# EAGLE design tinyI2C (EAGLE 7.5.0)
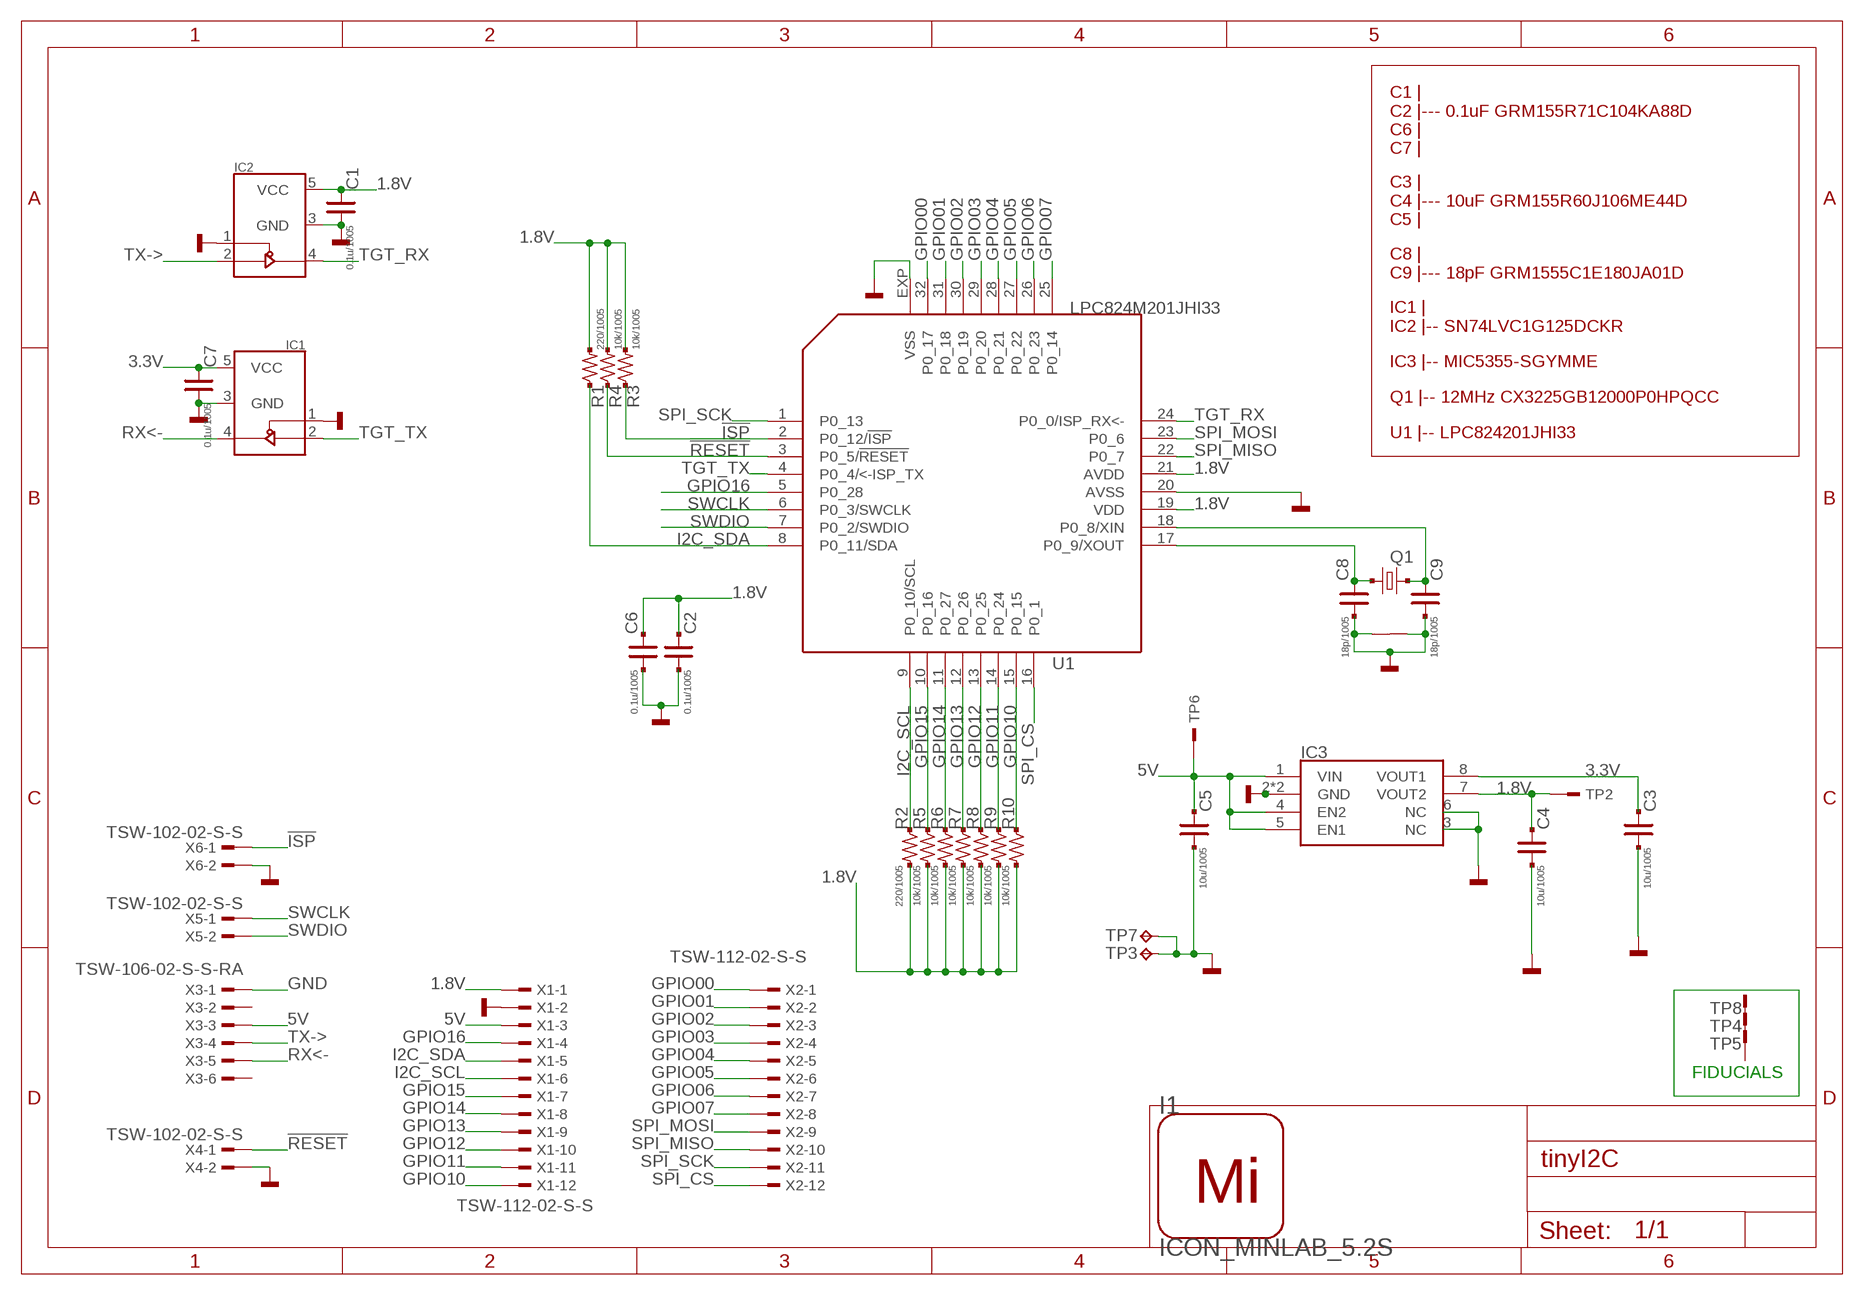
[diagram p0: schematic, sheet 1]

## Parts
C1  0.1u/1005  C_SMD_0.1U_1005  [C0402]
C2  0.1u/1005  C_SMD_0.1U_1005  [C0402]
C3  10u/1005  C_SMD_10U_1005  [C0402]
C4  10u/1005  C_SMD_10U_1005  [C0402]
C5  10u/1005  C_SMD_10U_1005  [C0402]
C6  0.1u/1005  C_SMD_0.1U_1005  [C0402]
C7  0.1u/1005  C_SMD_0.1U_1005  [C0402]
C8  18p/1005  C_SMD_18P_1005  [C0402]
C9  18p/1005  C_SMD_18P_1005  [C0402]
I1  ICON_MINLAB_5.2S  [ICON_MINLAB_5.2MM]
IC1  74LVC1G125_SC70  [IC_05_0.635_40MIL]
IC2  74LVC1G125_SC70  [IC_05_0.635_40MIL]
IC3  IC_LDO_MIC5355_3.3/1.8  [IC_08_0.65_160MIL_EP]
Q1  CRYSTAL4_12M_3225  [CLOCK_3225]
R1  220/1005  R_US_220R_1005  [C0402]
R2  220/1005  R_US_220R_1005  [C0402]
R3  10k/1005  R_US_10K_1005  [C0402]
R4  10k/1005  R_US_10K_1005  [C0402]
R5  10k/1005  R_US_10K_1005  [C0402]
R6  10k/1005  R_US_10K_1005  [C0402]
R7  10k/1005  R_US_10K_1005  [C0402]
R8  10k/1005  R_US_10K_1005  [C0402]
R9  10k/1005  R_US_10K_1005  [C0402]
R10  10k/1005  R_US_10K_1005  [C0402]
TP2  TESTPAD  [TP06RECT]
TP3  TPTP14R  [TP14R]
TP4  TESTPAD_F  [FIDUCIAL]
TP5  TESTPAD_F  [FIDUCIAL]
TP6  TESTPAD  [TP06RECT]
TP7  TPTP14R  [TP14R]
TP8  TESTPAD_F  [FIDUCIAL]
U1  LPC824M201JHI33  [HVQFN33]
X1  TSW-112-02-S-S  [TSW-112-02-S-S]
X2  TSW-112-02-S-S  [TSW-112-02-S-S]
X3  TSW-106-02-S-S-RA  [TSW-106-02-S-S-RA]
X4  TSW-102-02-S-S  [TSW-102-02-S-S]
X5  TSW-102-02-S-S  [TSW-102-02-S-S]
X6  TSW-102-02-S-S  [TSW-102-02-S-S]

## Nets
1.8V: C1.1 C2.1 C4.1 C6.1 IC2.5(VCC) IC3.7(VOUT2) R1.2 R2.2 R3.2 R4.2 R5.2 R6.2 R7.2 R8.2 R9.2 R10.2 TP2.TP U1.19(VDD) U1.21(AVDD) X1.1
3.3V: C3.1 C7.1 IC1.5(VCC) IC3.8(VOUT1)
5V: C5.1 IC3.1(VIN) IC3.4(EN2) IC3.5(EN1) TP6.TP X1.3 X3.3
!ISP!: R3.1 U1.2(P0_12/!ISP!) X6.1
!RESET!: R4.1 U1.3(P0_5/!RESET!) X4.1
GND: C1.2 C2.2 C3.2 C4.2 C5.2 C6.2 C7.2 C8.2 C9.2 IC1.1(!OE!) IC1.3(GND) IC2.1(!OE!) IC2.3(GND) IC3.2(GND) IC3.3(NC) IC3.6(NC) IC3.EXP(GND) Q1.2 Q1.4 TP3.TP TP7.TP U1.20(AVSS) U1.EXP(VSS) X1.2 X3.1 X4.2 X6.2
GPIO00: U1.32(P0_17) X2.1
GPIO01: U1.31(P0_18) X2.2
GPIO02: U1.30(P0_19) X2.3
GPIO03: U1.29(P0_20) X2.4
GPIO04: U1.28(P0_21) X2.5
GPIO05: U1.27(P0_22) X2.6
GPIO06: U1.26(P0_23) X2.7
GPIO07: U1.25(P0_14) X2.8
GPIO10: R10.1 U1.15(P0_15) X1.12
GPIO11: R9.1 U1.14(P0_24) X1.11
GPIO12: R8.1 U1.13(P0_25) X1.10
GPIO13: R7.1 U1.12(P0_26) X1.9
GPIO14: R6.1 U1.11(P0_27) X1.8
GPIO15: R5.1 U1.10(P0_16) X1.7
GPIO16: U1.5(P0_28) X1.4
I2C_SCL: R2.1 U1.9(P0_10/SCL) X1.6
I2C_SDA: R1.1 U1.8(P0_11/SDA) X1.5
N$1: C8.1 Q1.1 U1.17(P0_9/XOUT)
N$3: C9.1 Q1.3 U1.18(P0_8/XIN)
RX<-: IC1.4(Y) X3.5
SPI_CS: U1.16(P0_1) X2.12
SPI_MISO: U1.22(P0_7) X2.10
SPI_MOSI: U1.23(P0_6) X2.9
SPI_SCK: U1.1(P0_13) X2.11
SWCLK: U1.6(P0_3/SWCLK) X5.1
SWDIO: U1.7(P0_2/SWDIO) X5.2
TGT_RX: IC2.4(Y) U1.24(P0_0/ISP_RX<-)
TGT_TX: IC1.2(A) U1.4(P0_4/<-ISP_TX)
TX->: IC2.2(A) X3.4
Unconnected: TP4.TP TP5.TP TP8.TP X3.2 X3.6

## Notes on the sheet
- C1 |
  C2 |--- 0.1uF GRM155R71C104KA88D
  C6 |
  C7 |
- C3 |
  C4 |--- 10uF GRM155R60J106ME44D
  C5 |
- C8 |
  C9 |--- 18pF GRM1555C1E180JA01D
- IC1 |
  IC2 |-- SN74LVC1G125DCKR
- IC3 |-- MIC5355-SGYMME
- Q1 |-- 12MHz CX3225GB12000P0HPQCC
- U1 |-- LPC824201JHI33
- FIDUCIALS

## Library data of the parts
C1 C2 C6 C7 = mylib:C_SMD_*: SMD CAPACITOR : PAD - PAD; DIGIKEY: 490-3261-1-ND
C3-C5 = mylib:C_SMD_*: SMD CAPACITOR : PAD - PAD; MOUSER: 81-GRM155R60J106ME4D
C8 C9 = mylib:C_SMD_*: SMD CAPACITOR : PAD - PAD; DIGIKEY: 490-5858-1-ND
I1 = mylib:ICON_MINLAB
IC1 IC2 = mylib:74*1G125: SINGLE BUS BUFFER GATE w/ 3-State Output; MOUSER: 595-SN74LVC1G125DCKR
IC3 = mylib:IC_LDO_MIC5355_*; DIGIKEY: 576-3882-5-ND; MOUSER: 998-MIC5355-SGYMME
Q1 = mylib:CRYSTAL4_*; DIGIKEY: 1253-1168-1-ND
R1 R2 = mylib:R_US_*: R_US_PAD_PAD : SMD R PAD is NTH-NTH Packages : _1608 : 1.6 x 0.8 mm _2125 : 2.0 x 1.25 mm _3216 : 3.2 x 1.6 mm
R3-R10 = mylib:R_US_*: R_US_PAD_PAD : SMD R PAD is NTH-NTH Packages : _1608 : 1.6 x 0.8 mm _2125 : 2.0 x 1.25 mm _3216 : 3.2 x 1.6 mm; DIGIKEY: P10.0KLCT-ND
TP2 TP4-TP6 TP8 = mylib:TESTPAD
TP3 TP7 = testpad_local:TP: Test pad
U1 = mylib:LPC824M201JHI33
X1 X2 = con-samtec.local:TSW-112-02-S-S: THROUGH-HOLE .025" SQ POST HEADER Source: Samtec TSW.pdf
X3 = con-samtec.local:TSW-106-02-S-S: THROUGH-HOLE .025" SQ POST HEADER Source: Samtec TSW.pdf
X4-X6 = con-samtec.local:TSW-102-02-S-S: THROUGH-HOLE .025" SQ POST HEADER Source: Samtec TSW.pdf

## Net classes
0 default: clearance 0.2 mm
1 power: clearance 0.2 mm

## Board
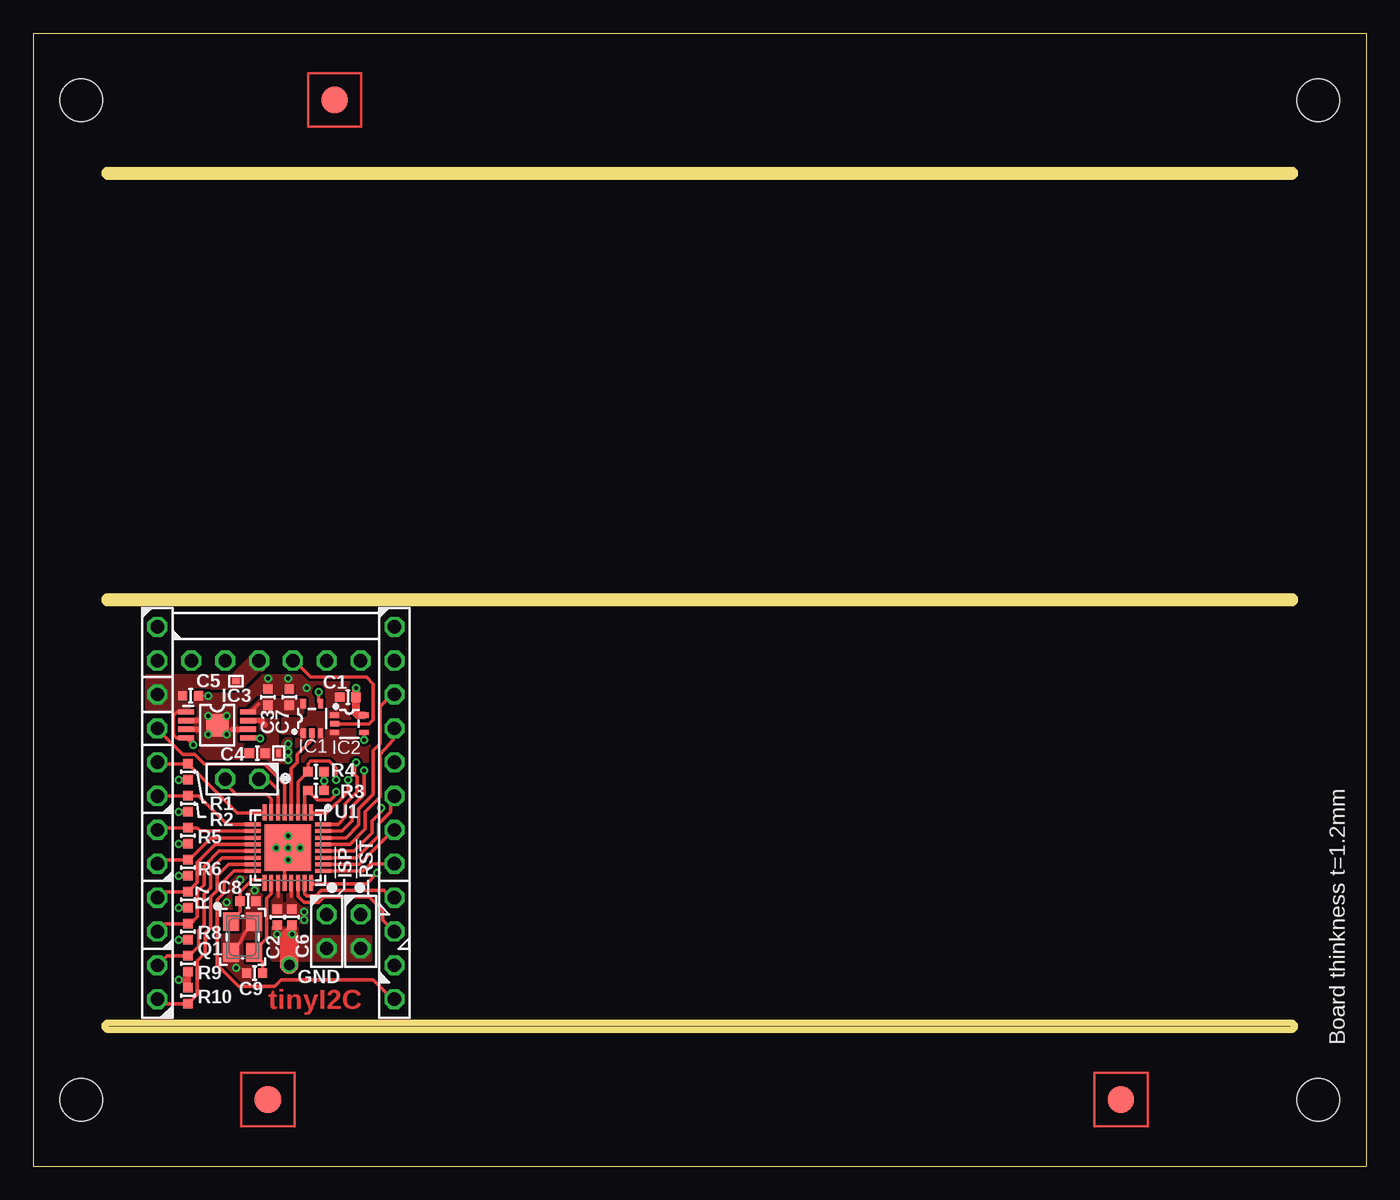
[diagram p1: board, top side]
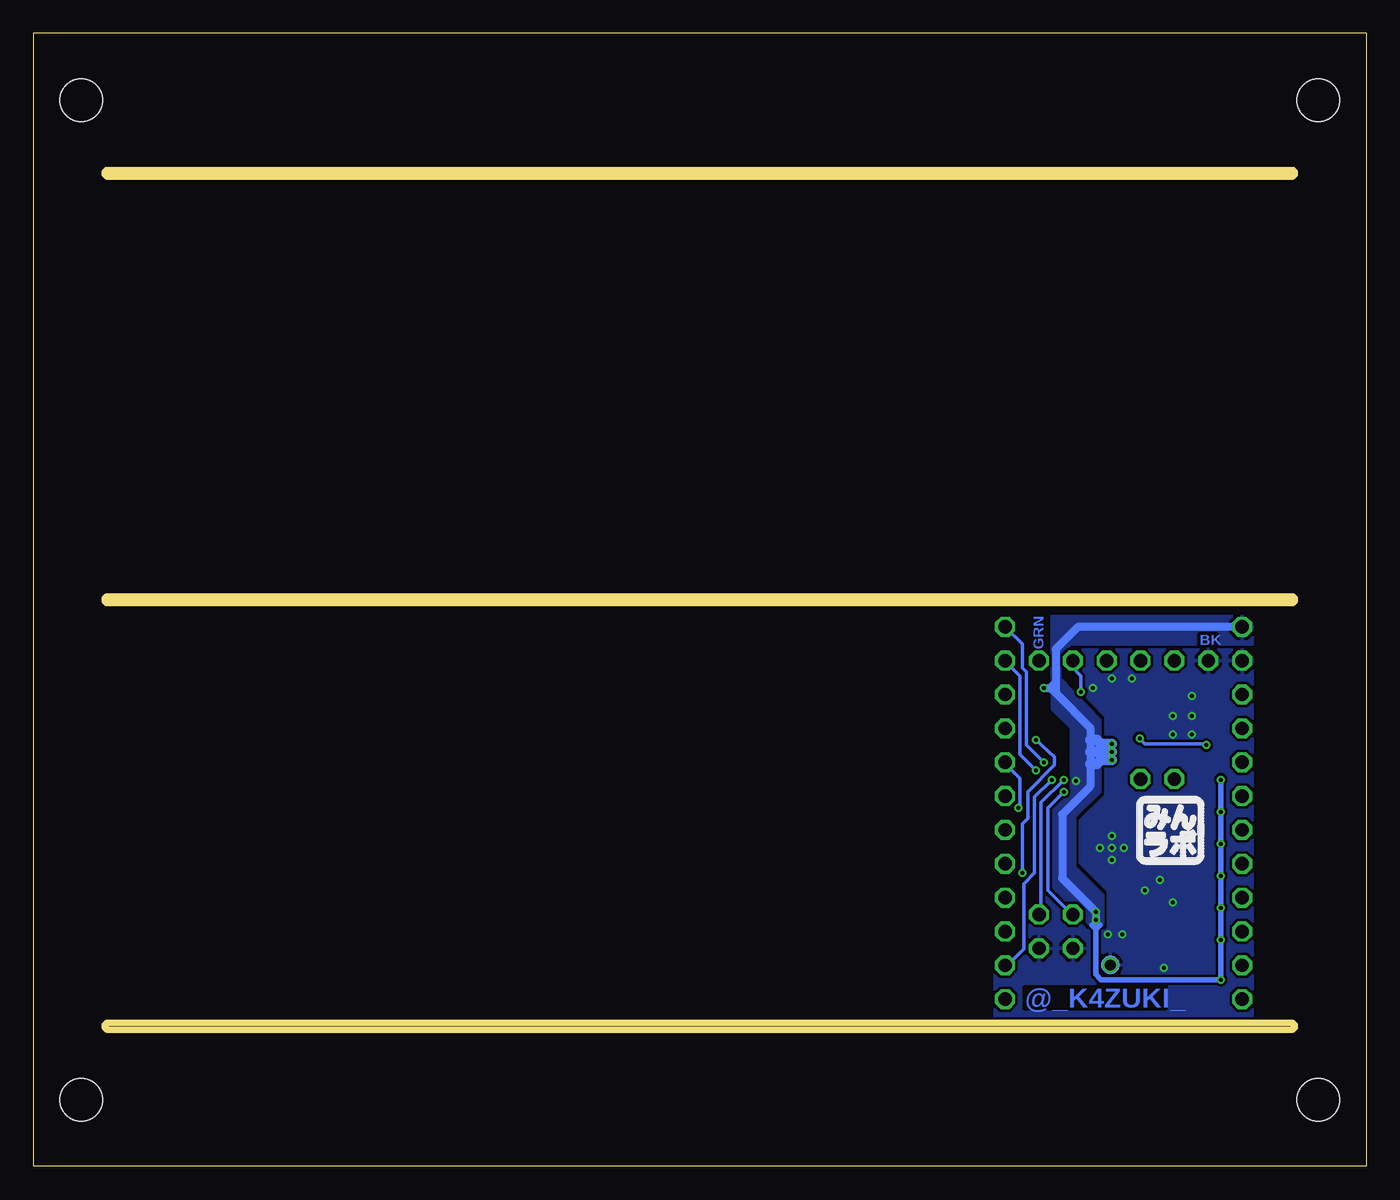
[diagram p2: board, bottom side, seen from below]

Size 100 x 85 mm. Coordinates in mm from the lower left corner, seen from the top.
Outline: 0,85 100,85 100,0 0,0 0,85
Copper layers (1*16): Top 0.035mm / dielectric 1.5mm / Bottom 0.035mm
Design rules "default *": minimum track width 0.15mm, minimum drill 0.3mm, track to track 0.15mm, track to pad 0.15mm, pad to pad 0.15mm, via to via 0.15mm, smd to smd 0mil, copper to edge 0.4mm, drill to drill 8mil, minimum pad ring 0.15mm, minimum via ring 0.15mm, stop-mask expansion 0.05mm, vias tented up to drill 100mil, thermal gap 10mil
Holes 3.2 mm at 3.6,80 96.4,5 96.4,80 3.6,5
tRestrict: 37 lines
bRestrict: 6 lines
Milling: area 5.3,74.2 to 94.7,74.8; area 5.3,42.2 to 94.7,42.8; area 5.3,10.2 to 94.7,10.8

### Footprints (pad centres in the part's own frame; a part is rotated, then mirrored left to right if it is on the bottom)
C0402 = smd 0.7 x 0.7: 1 -0.6,0; 2 0.6,0
IC_05_0.635_40MIL = smd 0.4 x 0.7: 1 -0.65,-1.1; 2 0,-1.1; 3 0.65,-1.1; 4 0.65,1.1; 5 -0.65,1.1
IC_08_0.65_160MIL_EP = smd 0.4 x 1.2: 1 -0.976,-2.313; 2 -0.326,-2.313; 3 0.324,-2.313; 4 0.974,-2.313; 5 0.974,2.312; 6 0.324,2.312; 7 -0.326,2.312; 8 -0.976,2.312 | smd 1.7 x 1.7: EXP 0,0
CLOCK_3225 = smd 1.4 x 1.2: 1 -1.15,-0.85; 2 1.15,-0.85; 3 1.15,0.85; 4 -1.15,0.85
TP06RECT = smd 0.4 x 0.6: TP 0,0
TP14R = smd 1.4 x 1.4: TP 0,0
FIDUCIAL = smd 2 x 2: TP 0,0
HVQFN33 = smd 1.2 x 0.3: 1 -2.65,1.75; 2 -2.65,1.25; 3 -2.65,0.75; 4 -2.65,0.25; 5 -2.65,-0.25; 6 -2.65,-0.75; 7 -2.65,-1.25; 8 -2.65,-1.75; 17 2.65,-1.75; 18 2.65,-1.25; 19 2.65,-0.75; 20 2.65,-0.25; 21 2.65,0.25; 22 2.65,0.75; 23 2.65,1.25; 24 2.65,1.75 | smd 0.3 x 1.2: 9 -1.75,-2.65; 10 -1.25,-2.65; 11 -0.75,-2.65; 12 -0.25,-2.65; 13 0.25,-2.65; 14 0.75,-2.65; 15 1.25,-2.65; 16 1.75,-2.65; 25 1.75,2.65; 26 1.25,2.65; 27 0.75,2.65; 28 0.25,2.65; 29 -0.25,2.65; 30 -0.75,2.65; 31 -1.25,2.65; 32 -1.75,2.65 | smd 3.5 x 3.5: EXP 0,0
TSW-112-02-S-S = drill 1 pad 1.5 octagon: 1 13.97,0; 2 11.43,0; 3 8.89,0; 4 6.35,0; 5 3.81,0; 6 1.27,0; 7 -1.27,0; 8 -3.81,0; 9 -6.35,0; 10 -8.89,0; 11 -11.43,0; 12 -13.97,0
TSW-106-02-S-S-RA = drill 1 pad 1.5 octagon: 1 6.35,1.524; 2 3.81,1.524; 3 1.27,1.524; 4 -1.27,1.524; 5 -3.81,1.524; 6 -6.35,1.524
TSW-102-02-S-S = drill 1 pad 1.5 octagon: 1 1.27,0; 2 -1.27,0

### Placement (x,y rotation side)
C1  23.6,35.2 180 top
C2  18.3,18.7 270 top
C3  17.6,35.2 90 top
C4  16.8,31 180 top
C5  11.8,35.3 0 top
C6  19.4,18.7 270 top
C7  19.2,35.2 90 top
C8  16.1,19.9 0 top
C9  16.6,14.5 180 top
I1  17.2,22.7 0 bottom
IC1  20.9,33.6 0 top
IC2  23.7,33.2 270 top
IC3  13.8,33.1 270 top
Q1  15.7,17.2 270 top
R1  11.6,29.6 270 top
R2  11.6,27.2 270 top
R3  21.2,28.2 0 top
R4  21.2,29.6 0 top
R5  11.6,24.8 270 top
R6  11.6,22.4 270 top
R7  11.6,20 270 top
R8  11.6,17.6 270 top
R9  11.6,15.2 270 top
R10  11.6,12.8 90 top
TP2  18.4,31 0 top
TP3  19.2,15.1 0 top
TP4  22.6,80 0 top
TP5  81.6,5 0 top
TP6  15.2,36.4 90 top
TP7  19.2,15.1 0 bottom
TP8  17.6,5 0 top
U1  19.1,23.9 270 top
X1  9.31,26.5 90 top
X2  27.09,26.5 90 top
X3  18.2,39.45 180 top
X4  24.55,17.61 90 top
X5  15.66,29.04 0 top
X6  22.01,17.61 90 top

### Tracks (layer width: path | path; a pad name or v marks a point on that pad's centre or on a via)
1.8V  (via drill 0.3, 0.3 pad 0.6)
  Top 0.25: U1.21 19.35,20.25 | U1.19 18.35,20.25
  Top 0.4: IC3.7 17.07,33.43 17.4,33.1 | R4.2 v21.8,28.9 R3.2 | R1.2 v10.9,29 | R2.2 v10.9,26.6 | R5.2 v10.9,24.2 | R6.2 v10.9,21.8 | R7.2 v10.9,19.4 | R8.2 v10.9,17 | R9.2 11.6,14 | 11.6,14 R10.2 | v10.9,14 11.6,14
  Top 0.6: v24.2,35.9 C1.1 24.2,34 24.35,33.85 IC2.5
  Bottom 0.4: v10.9,29 v10.9,26.6 v10.9,24.2 v10.9,21.8 v10.9,19.4 v10.9,17 v10.9,14 19.9,14 20.3,14.4 20.3,17.8 | 20.3,17.8 20.3,18.1 | 20.3,18.1 v20.3,18.5 | 20.3,17.8 20,18.1 20.3,18.1 | 20.3,18.1 20.6,18.1 20.3,17.8
  Bottom 0.6: X1.1 21.63,40.47 23.3,38.8 23.3,36.3 | 23.3,36.3 23.3,36.1 | 23.3,36.1 23.3,35.5 | 23.3,35.5 20.7,32.9 20.7,32 20.7,31.1 20.7,30.2 20.7,28.5 22.8,26.4 22.8,21.6 v20.3,19.1 20.3,18.1 | 23.7,35.9 23.5,35.9 23.3,36.1 | 23.7,35.9 23.3,36.3 | v24.2,35.9 23.7,35.9 | 23.7,35.9 23.3,35.5
  Bottom 0.8: v19.1,31.7 19.9,31.7 20.2,32 20.7,32 | v19.1,31.1 20.7,31.1 | v19.1,30.5 19.9,30.5 20.2,30.2 20.7,30.2
  pour Bottom: 21.9,22.5 21.9,26.2 20,28.1 20,33.5 23,36.6 23,38.4 22.2,39.2 8.1,39.2 8.1,41.9 23.6,41.9 23.5,20.9 20.7,18.1 19.8,18.1 19.8,20.4
  pour Top (no thermals): 19.3,33.5 17,33.5 17,30.3 19.3,30.3
  pour Top (no thermals): 20.5,20.6 17.6,20.6 17.6,18.3 20.5,18.3
3.3V
  Top 0.25: IC3.8 16.28,34.08 16.9,34.7
  pour Top (no thermals): 20.2,34 20.2,35 17,35 16,34
5V  (via drill 0.3)
  Top 0.25: 16.97,32.13 v17,32.1 | v12,31.6 11.47,32.13 IC3.4 10.77,32.13 10.5,32.4 10.5,33.8 10.78,34.08 IC3.1
  Top 0.4: IC3.5 16.97,32.13
  Bottom 0.25: v12,31.6 12.1,31.7 16.6,31.7 v17,32.1
  pour Top (rank 3, no thermals): 8.1,34.1 12,34.1 12,35.9 15.8,35.9 17.3,37.4 16.4,38.3 14.9,36.8 8.1,36.8
!ISP!  (via drill 0.3)
  Top 0.25: v22.7,28.1 22.7,27.9 22.3,27.5 21.3,27.5 R3.1 20.35,27.95 U1.2
  Bottom 0.25: X6.1 22.08,18.88 23.9,20.7 23.9,26.9 v22.7,28.1
!RESET!  (via drill 0.3)
  Top 0.25: U1.3 19.85,28.85 R4.1 20.6,30.2 20.8,30.4 22.2,30.4 22.7,29.9 v22.7,29
  Bottom 0.25: X4.1 24.4,19.03 24.4,27.3 v22.7,29
GND  (via drill 0.3, 0.8)
  Top 0.25: U1.EXP 18.85,23.65 U1.20 | 12.37,33.43 12.4,33.4 | Q1.4 16.55,18.15 15.9,17.6 15.5,16.8 14.85,16.25 Q1.2 | 12.38,32.78 12.4,32.8 | 14.92,32.78 14.9,32.8
  Top 0.4: IC3.2 12.37,33.43 | IC3.3 12.38,32.78 | IC3.6 14.92,32.78
  Top 0.8: 19.2,17.2 v19.4,17.4
  Top 1.4: TP7.TP 19.2,17.2
  other vias: 18.3,17.4 20.5,35.9 15.2,14.9 16.6,20.7 13.1,35.3 17.6,36.6 19.1,36.6 19.2,15.1 15.5,21.5 14.5,19.8 19.1,24.8 18.2,23.9 20,23.9 19.1,23 19.1,23.9 14.5,33.8 14.5,32.4 13.1,32.4 13.1,33.8
  pour Bottom (rank 2): 8,41.7 28.3,41.7 28.3,11.3 8.1,11.3
  pour Top (rank 2, no thermals): 17.9,17.9 17.9,15.5 25.3,15.5 25.3,17.2 19.8,17.2 19.8,17.9
  pour Top (rank 2, no thermals): 12.1,35.4 15.8,35.4 17.2,36.8 25.2,36.8 25.2,30.4 12.1,30.4
  pour Top (rank 2, no thermals): 14.1,22.1 14.2,13.8 17.4,13.8 17.3,22.1
GPIO00  (via drill 0.3 pad 0.6)
  Top 0.25: v24.2,30.3 24.1,30.2 24.1,29.4 24.3,29.2 24.3,28.1 23.4,27.2 23.4,26.2 22.85,25.65 U1.32
  Bottom 0.25: v24.2,30.3 25.5,31.6 25.5,37.1 25.8,37.4 25.8,39.18 X2.1
GPIO01  (via drill 0.3)
  Top 0.25: U1.31 23.15,25.15 23.9,25.9 23.9,27 24.8,27.9 v24.8,29.7
  Bottom 0.25: v24.8,29.7 26,30.9 26,36.8 27,37.8 27,37.84 X2.2
GPIO02
  Top 0.25: X2.3 26.89,35.39 26,34.5 26,31.7 25.5,31.2 25.5,27.9 24.4,26.8 24.4,25.6 23.45,24.65 U1.30
GPIO03
  Top 0.25: U1.29 23.75,24.15 24.9,25.3 24.9,26.6 26,27.7 26,30.9 27,32 27,32.76 X2.4
GPIO04  (via drill 0.3 pad 0.6)
  Top 0.25: U1.28 24.05,23.65 25.4,25 25.4,25.9 26.1,26.6 v26.1,26.9
  Bottom 0.25: v26.1,26.9 26,27 26,29.1 27,30.1 27,30.22 X2.5
GPIO05
  Top 0.25: U1.27 24.25,23.15 25.9,24.8 25.9,25.7 26.8,26.6 26.8,27.48 X2.6
GPIO06
  Top 0.25: X2.7 27.03,25.23 24.45,22.65 U1.26
GPIO07
  Top 0.25: U1.25 24.75,22.15 25.29,22.69 X2.8
GPIO10
  Top 0.25: U1.15 14.65,22.65 13.8,21.8 13.8,20.7 13.3,20.2 13.3,17.9 12.9,17.5 12.9,16 12.3,15.4 12.3,12.9 R10.1 9.64,12.2 X1.12
GPIO11
  Top 0.25: U1.14 14.15,23.15 13.3,22.3 13.3,20.9 12.8,20.4 12.8,18.1 12.4,17.7 12.4,16.5 11.7,15.8 R9.1 10.04,15.8 X1.11
GPIO12
  Top 0.25: U1.13 13.95,23.65 12.8,22.5 12.8,21.1 12.3,20.6 12.3,18.7 11.8,18.2 R8.1 9.9,18.2 X1.10
GPIO13
  Top 0.25: U1.12 13.65,24.15 12.3,22.8 12.3,21.3 R7.1 9.76,20.6 X1.9
GPIO14
  Top 0.25: U1.11 13.35,24.65 11.7,23 R6.1 9.62,23 X1.8
GPIO15
  Top 0.25: X1.7 9.48,25.4 R5.1 12.3,25.4 12.55,25.15 U1.10
GPIO16
  Top 0.25: X1.4 9.25,32.85 11.2,30.9 12.1,30.9 12.8,30.2 17.3,30.2 18.85,28.65 U1.5
I2C_SCL
  Top 0.25: X1.6 9.34,27.8 R2.1 12.4,27.8 14.55,25.65 U1.9
I2C_SDA
  Top 0.25: U1.8 17.3,26.5 17.2,26.5 | 17.2,26.5 15.3,26.5 R1.1 9.4,30.2 X1.5 | 17.2,26.5 17.3,26.6 | 17.2,26.5 17.3,26.4
N$1
  Top 0.25: U1.17 17.35,21.5 17.2,21.5 | 17.2,21.5 16.4,21.5 15.5,20.6 C8.1 15.5,19.1 14.9,18.5 14.9,18.4 Q1.1 | 17.2,21.5 17.3,21.6 | 17.2,21.5 17.3,21.4
N$3
  Top 0.25: U1.18 17.85,20.45 17.5,20.1 17.5,17.1 16.55,16.15 Q1.3 16.55,15.95 17.2,15.3 C9.1
RX<-  (via drill 0.3)
  Top 0.25: v21.4,35.6 21.4,34.85 IC1.4
  Bottom 0.25: X3.5 22.01,37.41 21.4,36.8 v21.4,35.6
SPI_CS
  Top 0.25: U1.16 15.05,22.15 14.3,21.4 14.3,20.5 13.8,20 13.8,15.1 15.4,13.5 18.1,13.5 18.6,14 25.5,14 26.97,12.53 X2.12
SPI_MISO
  Top 0.25: U1.22 19.85,20.25 20.3,19.8 21.4,19.8 21.8,20.2 25.2,20.2 26.2,19.2 26.2,18.5 X2.10
SPI_MOSI
  Top 0.25: U1.23 20.35,20.45 20.5,20.3 21.2,20.3 21.6,20.7 26.3,20.7 26.8,20.2 27.04,20.2 X2.9
SPI_SCK  (via drill 0.3)
  Top 0.25: v23.6,29 23.6,28.1 22,26.5 21,26.5 | 21,26.5 20.9,26.5 U1.1 | 21,26.5 20.9,26.6 | 21,26.5 20.9,26.4
  Bottom 0.25: X2.11 26.93,15.07 25.7,16.3 25.7,21.2 24.9,22 24.9,27.7 v23.6,29
SWCLK
  Top 0.25: U1.6 18.35,28.25 17.63,28.97 17,28.97 X5.1
SWDIO
  Top 0.25: U1.7 17.85,27.55 17.5,27.9 15.2,27.9 14.39,28.71 X5.2
TGT_RX  (via drill 0.3)
  Top 0.25: v25.8,22 25,21.2 21,21.2 | 21,21.2 20.9,21.2 U1.24 | 21,21.2 20.9,21.3 | 21,21.2 20.9,21.1 | v24.8,32 IC2.4
  Bottom 0.25: v25.8,22 25.8,25.7 25.4,26.1 25.4,28.1 23.4,30.1 23.4,30.7 v24.8,32
TGT_TX
  Top 0.25: U1.4 19.35,29.85 19.8,30.3 19.8,30.9 20.9,32 IC1.2
TX->
  Top 0.25: X3.4 19.57,37.93 20.8,36.7 25,36.7 25.5,36.2 25.5,33.5 25.2,33.2 IC2.2

### Text on the board
Top: tinyI2C
Bottom: GRN | BK | @_K4ZUKI_
tPlace: !ISP | !RST | GND | Board thinkness t=1.2mm
Vscore: V-CUT | V-CUT | V-CUT | V-CUT | V-CUT